# Altium schematic sheet LEDBoard.SchDoc
size A4
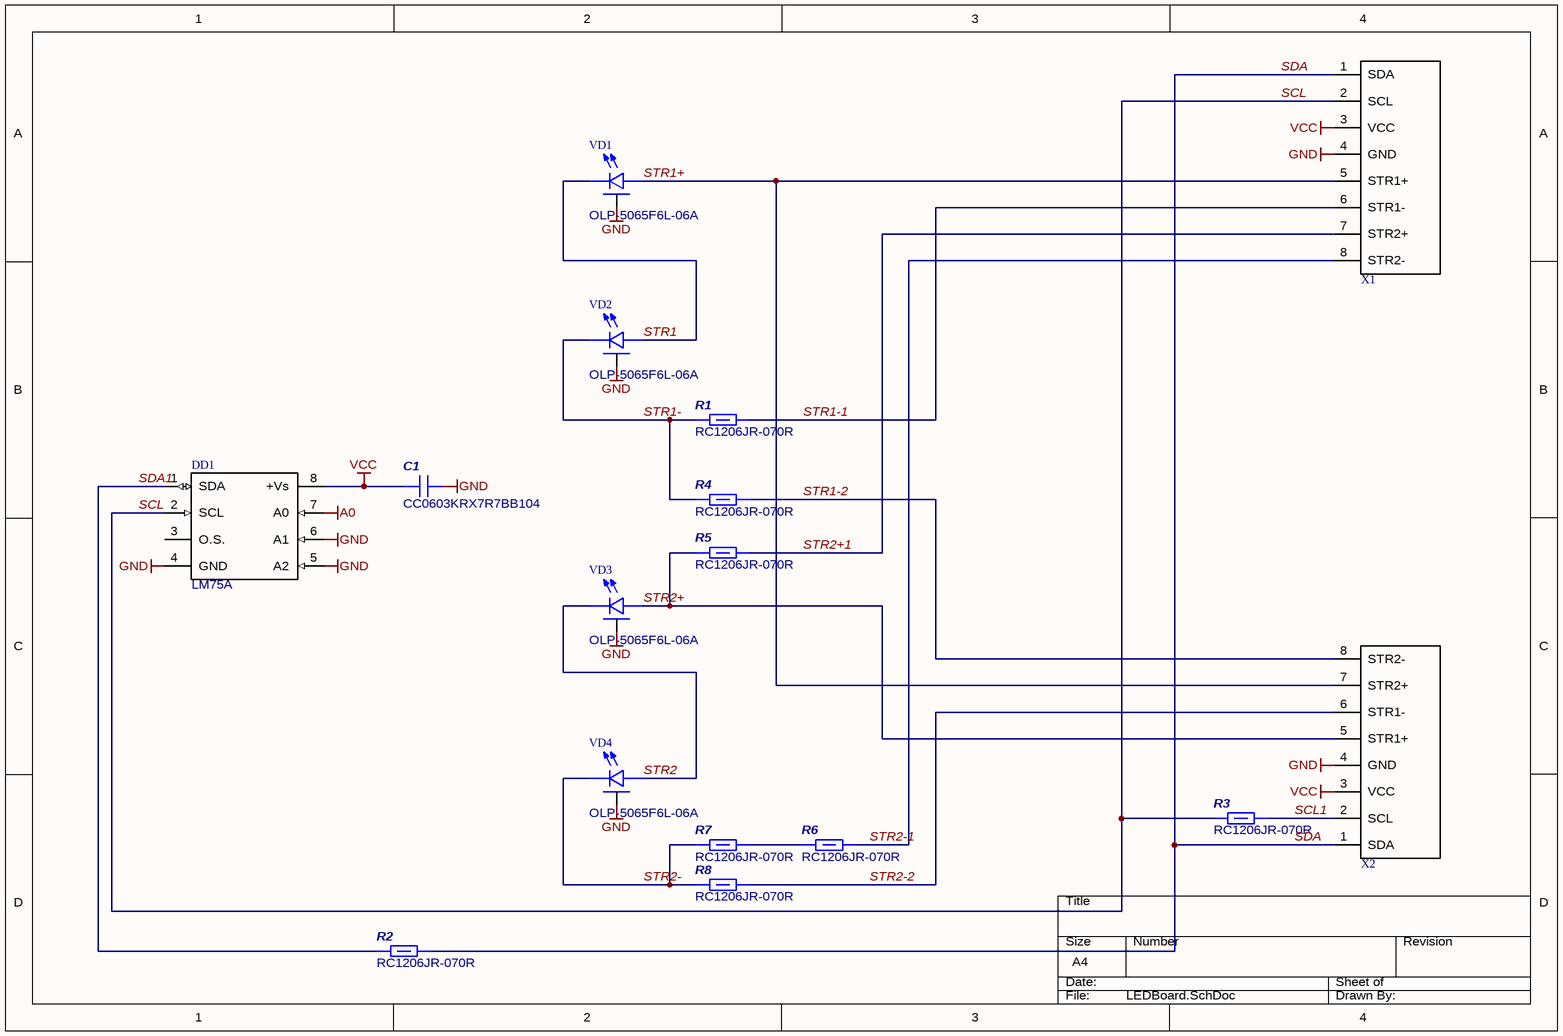
[diagram p0: LEDBoard.SchDoc]

## Parts
C1  CC0603KRX7R7BB104  [CapacitorSMD0603(manual)]
DD1  LM75A  [SO8_FLIPPED]
R1  RC1206JR-070R  [ResistorSMD1206(manual)]
R2  RC1206JR-070R  [ResistorSMD1206(manual)]
R3  RC1206JR-070R  [ResistorSMD1206(manual)]
R4  RC1206JR-070R  [ResistorSMD1206(manual)]
R5  RC1206JR-070R  [ResistorSMD1206(manual)]
R6  RC1206JR-070R  [ResistorSMD1206(manual)]
R7  RC1206JR-070R  [ResistorSMD1206(manual)]
R8  RC1206JR-070R  [ResistorSMD1206(manual)]
VD1  OLP-5065F6L-06A  [OLP-5065F6L-06A(manualVar2)]
VD2  OLP-5065F6L-06A  [OLP-5065F6L-06A(manualVar2)]
VD3  OLP-5065F6L-06A  [OLP-5065F6L-06A(manualVar2)]
VD4  OLP-5065F6L-06A  [OLP-5065F6L-06A(manualVar2)]
X1  ConnectorLEDSide  [ConnectorLEDSide]  (value not drawn)  (no BOM)
X2  ConnectorLEDSide  [ConnectorLEDSide]  (value not drawn)  (no BOM)

## Nets
A0: DD1.7(A0)
GND: C1.1 DD1.4(GND) DD1.5(A2) DD1.6(A1) VD1.3 VD2.3 VD3.3 VD4.3 X1.4(GND) X2.4(GND)
VCC: C1.2 DD1.8(+Vs) X1.3(VCC) X2.3(VCC)
SCL: DD1.2(SCL) R3.1 X1.2(SCL)
SCL1: R3.2 X2.2(SCL)
SDA: R2.2 X1.1(SDA) X2.1(SDA)
SDA1: DD1.1(SDA) R2.1
STR1: VD1.1 VD2.2
STR1+: VD1.2 X1.5(STR1+) X2.7(STR2+)
STR1-: R1.1 R4.1 VD2.1
STR1-1: R1.2 X1.6(STR1-)
STR1-2: R4.2 X2.8(STR2-)
STR2: VD3.1 VD4.2
STR2+: R5.1 VD3.2 X2.5(STR1+)
STR2+1: R5.2 X1.7(STR2+)
STR2-: R7.1 R8.1 VD4.1
STR2-1: R6.2 X1.8(STR2-)
STR2-2: R8.2 X2.6(STR1-)
NetR6_1: R6.1 R7.2

Not connected (* = marked no-connect by the designer): DD1 3(O.S.)

## Library data of the parts
C1 = CapacitorSMD0603(reflow): CAPACITOR Capacitor SMD 0603 1.6x0.8mm; Описание: Конденсатор SMD 0603; NumberSolderPointsSMD: 0; Аналог: нет; NumberSolderPointsTHT: 0
DD1 = LM75A: IC Temperature sensor; Описание: Микросхема SO8; NumberSolderPointsSMD: 0; Аналог: нет; x: LM75AD,LM75AIM; NumberSolderPointsTHT: 0
R1-R8 = ResistorSMD1206: RESISTOR Resistor SMD 1210 3.1x1.6mm; Описание: Резистор SMD 1206; NumberSolderPointsSMD: 0; Аналог: нет; NumberSolderPointsTHT: 0
VD1-VD4 = OLP-5065F6L-06A: White LED 1.0W 155lm 3.0V 350mA; Описание: Светодиод SMD; Аналог: *; NumberSolderPointsSMD: *; NumberSolderPointsTHT: *; Комплект: *